# Altium project IMX93EVK-SOM.PrjPcb (part 6 of 6)
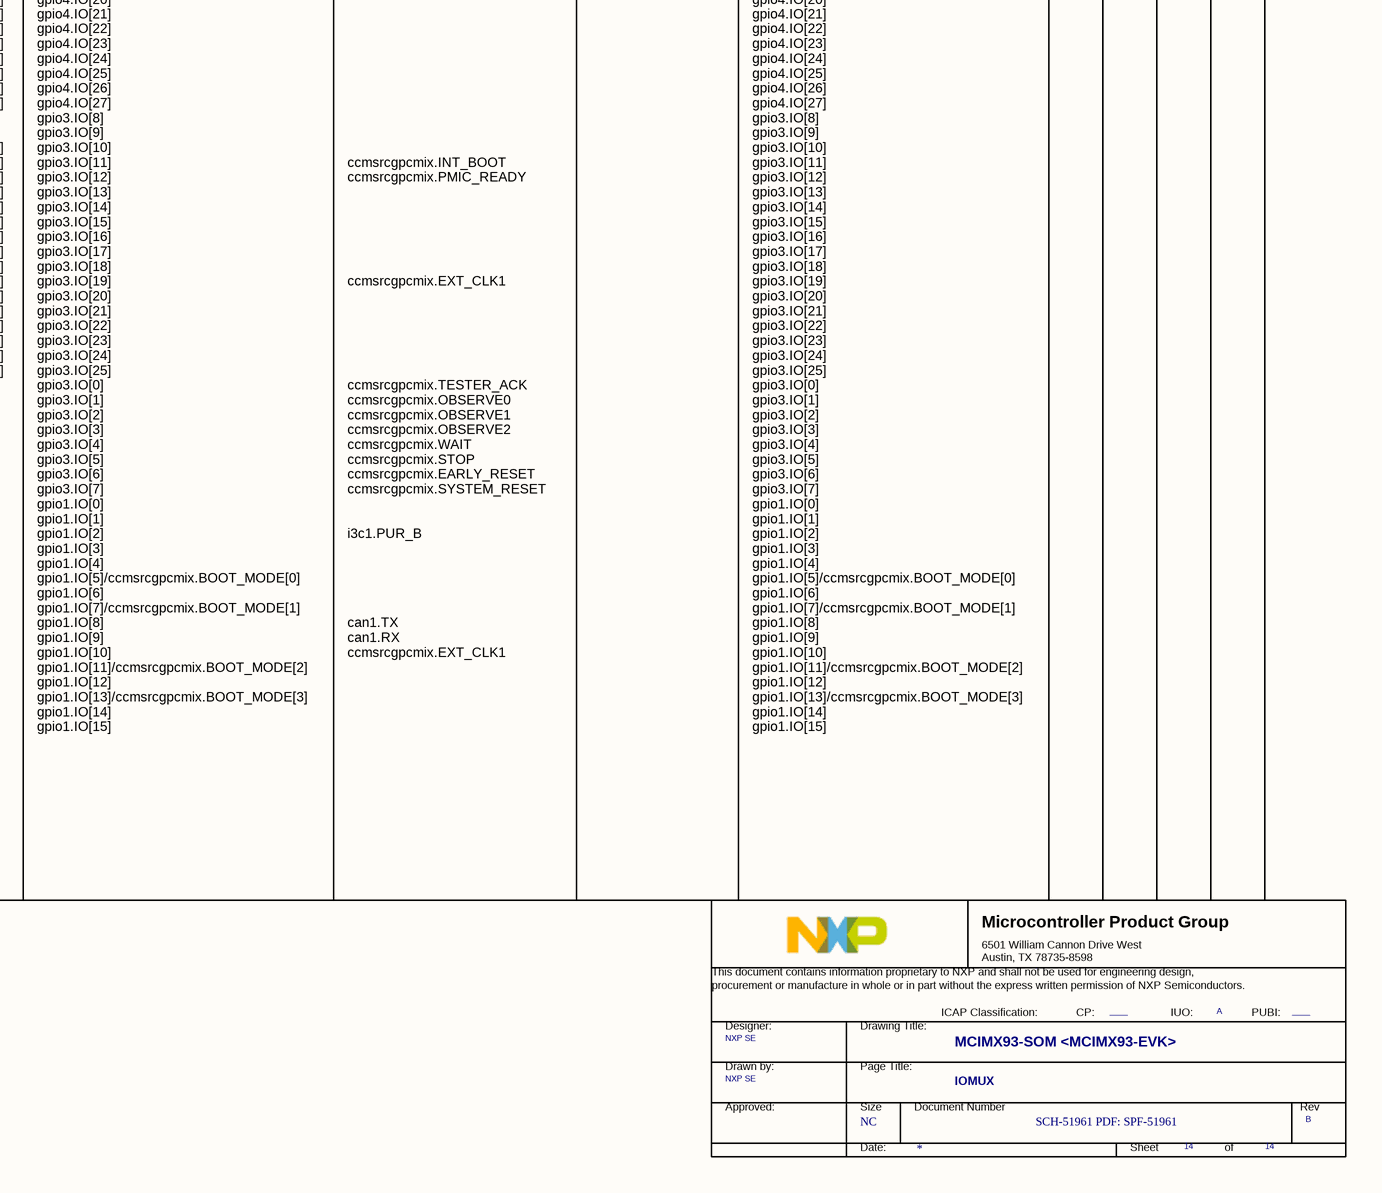
[diagram p34: X-14 IOMUX.SchDoc, bottom right]

## Nets that join several sheets
BB_VSYS_5V: C-11 SOM HDR (13 pins), C-12 PWR MEAS (9 pins)
GND: C-04 CPU PWR (95 pins), C-05 LPDDR4_x (84 pins), C-06 CPU IO_PHY (R302.1 R303.2 R305.2), C-07 CPU MISC (12 pins), C-08 eMMC (20 pins), C-09 BOOT_CFG (8 pins), C-10 PMIC (35 pins), C-11 SOM HDR (88 pins), C-12 PWR MEAS (75 pins)
LPD4/x_VDD1: C-05 LPDDR4_x (15 pins), C-12 PWR MEAS (R1006.1 R1014.2 TP947.1)
LPD4/x_VDD2: C-05 LPDDR4_x (34 pins), C-12 PWR MEAS (R1017.2 R1026.1 TP951.1)
LPD4/x_VDD2_1V1: C-04 CPU PWR (R109.2), C-05 LPDDR4_x (R203.1), C-10 PMIC (6 pins), C-12 PWR MEAS (8 pins)
LPD4/x_VDDQ: C-05 LPDDR4_x (30 pins), C-12 PWR MEAS (R923.1 R1007.2 TP949.1)
LPD4/x_VDDQ_0V6: C-04 CPU PWR (R110.2), C-05 LPDDR4_x (R206.1), C-10 PMIC (R702.2 R704.2 TP702.1), C-12 PWR MEAS (8 pins)
NVCC_1P8: C-04 CPU PWR (6 pins), C-12 PWR MEAS (R1004.2 R1029.1 TP943.1)
NVCC_3P3: C-04 CPU PWR (R107.1 R112.2 R113.2), C-12 PWR MEAS (R989.1 R1003.2 TP952.1)
NVCC_AON: C-04 CPU PWR (C119.1 R112.1 U101.L16), C-06 CPU IO_PHY (R306.1 R307.1 R308.1 R309.1), C-09 BOOT_CFG (5 pins), C-10 PMIC (R705.1), C-11 SOM HDR (C804.1 J803.90)
NVCC_BBSM_1P8: C-04 CPU PWR (C101.1 R101.2 U101.G12), C-12 PWR MEAS (R903.1 R918.1 R920.2 TP924.1)
NVCC_BBSM_1V8: C-04 CPU PWR (R101.1), C-07 CPU MISC (R401.1 R404.1 R405.1), C-10 PMIC (C727.1 R703.1 TP709.1 U701.3), C-11 SOM HDR (C809.1 J802.53), C-12 PWR MEAS (7 pins)
NVCC_GPIO: C-04 CPU PWR (C118.1 R113.1 U101.N15 U101.N16), C-11 SOM HDR (C806.1 J803.89)
NVCC_SD: C-04 CPU PWR (R108.2), C-10 PMIC (C731.1 TP713.1 U701.55), C-12 PWR MEAS (R929.1 R998.1 TP934.1)
NVCC_SD2: C-04 CPU PWR (C129.1 R108.1 U101.R16), C-06 CPU IO_PHY (R310.1 R311.1 R312.1), C-11 SOM HDR (C808.1 J803.55), C-12 PWR MEAS (R935.1 R998.2 TP935.1)
VDD2_DDR: C-04 CPU PWR (13 pins), C-12 PWR MEAS (R939.1 R944.2 R958.1 TP930.1)
VDD_1P8: C-10 PMIC (6 pins), C-12 PWR MEAS (R1041.1 R1044.1 TP959.1)
VDD_1V8: C-04 CPU PWR (L102.1 R106.2), C-05 LPDDR4_x (R202.1), C-08 eMMC (11 pins), C-10 PMIC (R712.1 R713.1 R727.2), C-11 SOM HDR (9 pins), C-12 PWR MEAS (9 pins)
VDD_3P3: C-10 PMIC (6 pins), C-12 PWR MEAS (R1040.1 R1042.1 TP957.1)
VDD_3V3: C-04 CPU PWR (R105.1 R107.2), C-08 eMMC (7 pins), C-09 BOOT_CFG (R605.1), C-10 PMIC (C724.2 R726.2 U701.22), C-11 SOM HDR (11 pins), C-12 PWR MEAS (9 pins)
VDD_ANA_0P8: C-04 CPU PWR (11 pins), C-12 PWR MEAS (R999.2 R1000.1 TP937.1)
VDD_ANA_0V8: C-04 CPU PWR (R103.1), C-10 PMIC (C730.1 TP712.1 U701.1), C-12 PWR MEAS (R997.1 R999.1 TP936.1)
VDD_ANA_1P8: C-04 CPU PWR (16 pins), C-12 PWR MEAS (R909.1 R1001.2 TP939.1)
VDD_ANA_1V8: C-04 CPU PWR (L102.2 R104.1 R111.2), C-12 PWR MEAS (R905.1 R1001.1 TP938.1)
VDD_SOC: C-04 CPU PWR (27 pins), C-10 PMIC (R711.2), C-12 PWR MEAS (R927.1 R932.2 R1020.1 TP927.1)
VDD_SOC_0V8: C-04 CPU PWR (R102.1), C-10 PMIC (6 pins), C-12 PWR MEAS (5 pins)
VDD_USB_3P3: C-04 CPU PWR (C155.1 R105.2 U101.G10), C-12 PWR MEAS (R996.1 R1002.2 TP941.1)
VDDQ_DDR: C-04 CPU PWR (9 pins), C-12 PWR MEAS (R943.1 R947.1 R974.2 TP933.1)
VLDO3_1V8: C-04 CPU PWR (R111.1), C-10 PMIC (C729.1 TP711.1 U701.54)
VSD2_3V3: C-11 SOM HDR (6 pins), C-12 PWR MEAS (R967.1 R1031.2 TP945.1)
VSD_3V3: C-10 PMIC (C725.1 U701.23), C-11 SOM HDR (R801.1), C-12 PWR MEAS (R957.1 R1031.1 TP944.1)
VSYS_5V: C-09 BOOT_CFG (TP607.1), C-10 PMIC (20 pins), C-11 SOM HDR (R802.1), C-12 PWR MEAS (R904.2 R916.1 R984.1 TP921.1)
ADC_IN0: C-07 CPU MISC (TP413.1 U101.B19), C-11 SOM HDR (J802.72)
ADC_IN1: C-07 CPU MISC (TP414.1 U101.A20), C-11 SOM HDR (J802.74)
ADC_IN2: C-07 CPU MISC (TP415.1 U101.B20), C-11 SOM HDR (J802.78)
ADC_IN3: C-07 CPU MISC (TP416.1 U101.B21), C-11 SOM HDR (J802.80)
CLKIN1: C-07 CPU MISC (R415.1 TP418.1 U101.B17), C-11 SOM HDR (J802.67)
CLKIN2: C-07 CPU MISC (R416.1 TP419.1 U101.A18), C-11 SOM HDR (J802.69)
CLKO01: C-07 CPU MISC (U101.AA2), C-11 SOM HDR (J801.79)
CLKO02: C-07 CPU MISC (U101.Y3), C-11 SOM HDR (J801.77)
CLKO03: C-07 CPU MISC (U101.U4), C-11 SOM HDR (J801.75)
CLKO04: C-07 CPU MISC (U101.V4), C-11 SOM HDR (J801.73)
CSI_CLK_N: C-06 CPU IO_PHY (U101.D10), C-11 SOM HDR (J802.47)
CSI_CLK_P: C-06 CPU IO_PHY (U101.E10), C-11 SOM HDR (J802.45)
CSI_D0_N: C-06 CPU IO_PHY (U101.A11), C-11 SOM HDR (J802.41)
CSI_D0_P: C-06 CPU IO_PHY (U101.B11), C-11 SOM HDR (J802.39)
CSI_D1_N: C-06 CPU IO_PHY (U101.A10), C-11 SOM HDR (J802.35)
CSI_D1_P: C-06 CPU IO_PHY (U101.B10), C-11 SOM HDR (J802.33)
DSI_CLK_N: C-06 CPU IO_PHY (U101.D6), C-11 SOM HDR (J802.3)
DSI_CLK_P: C-06 CPU IO_PHY (U101.E6), C-11 SOM HDR (J802.5)
DSI_D0_N: C-06 CPU IO_PHY (U101.A6), C-11 SOM HDR (J802.9)
DSI_D0_P: C-06 CPU IO_PHY (U101.B6), C-11 SOM HDR (J802.11)
DSI_D1_N: C-06 CPU IO_PHY (U101.A7), C-11 SOM HDR (J802.15)
DSI_D1_P: C-06 CPU IO_PHY (U101.B7), C-11 SOM HDR (J802.17)
DSI_D2_N: C-06 CPU IO_PHY (U101.A8), C-11 SOM HDR (J802.21)
DSI_D2_P: C-06 CPU IO_PHY (U101.B8), C-11 SOM HDR (J802.23)
DSI_D3_N: C-06 CPU IO_PHY (U101.A9), C-11 SOM HDR (J802.27)
DSI_D3_P: C-06 CPU IO_PHY (U101.B9), C-11 SOM HDR (J802.29)
ENET1_MDC: C-06 CPU IO_PHY (U101.AA11), C-11 SOM HDR (J801.37)
ENET1_MDIO: C-06 CPU IO_PHY (U101.AA10), C-11 SOM HDR (J801.39)
ENET1_RD0: C-06 CPU IO_PHY (U101.AA8), C-11 SOM HDR (J801.49)
ENET1_RD1: C-06 CPU IO_PHY (U101.Y9), C-11 SOM HDR (J801.47)
ENET1_RD2: C-06 CPU IO_PHY (U101.AA9), C-11 SOM HDR (J801.43)
ENET1_RD3: C-06 CPU IO_PHY (U101.Y10), C-11 SOM HDR (J801.41)
ENET1_RX_CTL: C-06 CPU IO_PHY (U101.Y8), C-11 SOM HDR (J801.51)
ENET1_RXC: C-06 CPU IO_PHY (U101.AA7), C-11 SOM HDR (J801.53)
ENET1_TD0: C-06 CPU IO_PHY (U101.W11), C-11 SOM HDR (J801.44)
ENET1_TD1: C-06 CPU IO_PHY (U101.T12), C-11 SOM HDR (J801.42)
ENET1_TD2: C-06 CPU IO_PHY (U101.U12), C-11 SOM HDR (J801.40)
ENET1_TD3: C-06 CPU IO_PHY (U101.V12), C-11 SOM HDR (J801.38)
ENET1_TX_CTL: C-06 CPU IO_PHY (U101.V10), C-11 SOM HDR (J801.48)
ENET1_TXC: C-06 CPU IO_PHY (U101.U10), C-11 SOM HDR (J801.50)
ENET2_MDC: C-06 CPU IO_PHY (U101.Y7), C-11 SOM HDR (J801.54)
ENET2_MDIO: C-06 CPU IO_PHY (U101.AA6), C-11 SOM HDR (J801.56)
ENET2_RD0: C-06 CPU IO_PHY (U101.AA4), C-11 SOM HDR (J801.63)
ENET2_RD1: C-06 CPU IO_PHY (U101.Y5), C-11 SOM HDR (J801.61)
ENET2_RD2: C-06 CPU IO_PHY (U101.AA5), C-11 SOM HDR (J801.59)
ENET2_RD3: C-06 CPU IO_PHY (U101.Y6), C-11 SOM HDR (J801.57)
ENET2_RX_CTL: C-06 CPU IO_PHY (U101.Y4), C-11 SOM HDR (J801.67)
ENET2_RXC: C-06 CPU IO_PHY (U101.AA3), C-11 SOM HDR (J801.69)
ENET2_TD0: C-06 CPU IO_PHY (U101.T8), C-11 SOM HDR (J801.66)
ENET2_TD1: C-06 CPU IO_PHY (U101.U8), C-11 SOM HDR (J801.64)
ENET2_TD2: C-06 CPU IO_PHY (U101.V8), C-11 SOM HDR (J801.60)
ENET2_TD3: C-06 CPU IO_PHY (U101.T10), C-11 SOM HDR (J801.58)
ENET2_TX_CTL: C-06 CPU IO_PHY (U101.V6), C-11 SOM HDR (J801.68)
ENET2_TXC: C-06 CPU IO_PHY (U101.U6), C-11 SOM HDR (J801.70)
GPIO_IO00: C-06 CPU IO_PHY (U101.J21), C-11 SOM HDR (J803.22)
GPIO_IO01: C-06 CPU IO_PHY (U101.J20), C-11 SOM HDR (J803.24)
GPIO_IO02: C-06 CPU IO_PHY (U101.K20), C-11 SOM HDR (J803.28)
GPIO_IO03: C-06 CPU IO_PHY (U101.K21), C-11 SOM HDR (J803.26)
GPIO_IO04: C-06 CPU IO_PHY (U101.L17), C-11 SOM HDR (J803.23)
GPIO_IO05: C-06 CPU IO_PHY (U101.L18), C-11 SOM HDR (J803.21)
GPIO_IO06: C-06 CPU IO_PHY (U101.L20), C-11 SOM HDR (J803.27)
GPIO_IO07: C-06 CPU IO_PHY (U101.L21), C-11 SOM HDR (J803.25)
GPIO_IO08: C-06 CPU IO_PHY (U101.M20), C-11 SOM HDR (J803.33)
GPIO_IO09: C-06 CPU IO_PHY (U101.M21), C-11 SOM HDR (J803.31)
GPIO_IO10: C-06 CPU IO_PHY (U101.N17), C-11 SOM HDR (J803.34)
GPIO_IO11: C-06 CPU IO_PHY (U101.N18), C-11 SOM HDR (J803.32)
GPIO_IO12: C-06 CPU IO_PHY (U101.N20), C-11 SOM HDR (J803.37)
GPIO_IO13: C-06 CPU IO_PHY (U101.N21), C-11 SOM HDR (J803.35)
GPIO_IO14: C-06 CPU IO_PHY (U101.P20), C-11 SOM HDR (J803.42)
GPIO_IO15: C-06 CPU IO_PHY (U101.P21), C-11 SOM HDR (J803.41)
GPIO_IO16: C-06 CPU IO_PHY (U101.R21), C-11 SOM HDR (J803.43)
GPIO_IO17: C-06 CPU IO_PHY (U101.R20), C-11 SOM HDR (J803.44)
GPIO_IO18: C-06 CPU IO_PHY (U101.R18), C-11 SOM HDR (J803.36)
GPIO_IO19: C-06 CPU IO_PHY (U101.R17), C-11 SOM HDR (J803.38)
GPIO_IO20: C-06 CPU IO_PHY (U101.T20), C-11 SOM HDR (J803.48)
GPIO_IO21: C-06 CPU IO_PHY (U101.T21), C-11 SOM HDR (J803.46)
GPIO_IO22: C-06 CPU IO_PHY (U101.U18), C-11 SOM HDR (J803.45)
GPIO_IO23: C-06 CPU IO_PHY (U101.U20), C-11 SOM HDR (J803.52)
GPIO_IO24: C-06 CPU IO_PHY (U101.U21), C-11 SOM HDR (J803.47)
GPIO_IO25: C-06 CPU IO_PHY (U101.V21), C-11 SOM HDR (J803.51)
GPIO_IO26: C-06 CPU IO_PHY (U101.V20), C-11 SOM HDR (J803.53)
GPIO_IO27: C-06 CPU IO_PHY (U101.W21), C-11 SOM HDR (J803.54)
GPIO_IO28: C-06 CPU IO_PHY (U101.W20), C-11 SOM HDR (J803.56)
GPIO_IO29: C-06 CPU IO_PHY (U101.Y21), C-11 SOM HDR (J803.58)
I2C1_SCL: C-06 CPU IO_PHY (R307.2 U101.C20), C-10 PMIC (R717.1), C-11 SOM HDR (J803.4)
I2C1_SDA: C-06 CPU IO_PHY (R306.2 U101.C21), C-10 PMIC (R719.1), C-11 SOM HDR (J803.2)
I2C2_SCL: C-06 CPU IO_PHY (R309.2 U101.D20), C-10 PMIC (R714.1), C-11 SOM HDR (J803.8)
I2C2_SDA: C-06 CPU IO_PHY (R308.2 U101.D21), C-10 PMIC (R715.1), C-11 SOM HDR (J803.6)
JTAG_TCK: C-07 CPU MISC (R403.1 TP404.1 U101.Y1), C-11 SOM HDR (J801.76)
JTAG_TDI: C-07 CPU MISC (TP402.1 U101.W1), C-11 SOM HDR (J801.80)
JTAG_TDO: C-07 CPU MISC (TP405.1 U101.Y2), C-11 SOM HDR (J801.74)
JTAG_TMS: C-07 CPU MISC (TP403.1 U101.W2), C-11 SOM HDR (J801.78)
LVDS_CLK_N: C-06 CPU IO_PHY (U101.A3), C-11 SOM HDR (J802.18)
LVDS_CLK_P: C-06 CPU IO_PHY (U101.B3), C-11 SOM HDR (J802.16)
LVDS_TX0_N: C-06 CPU IO_PHY (U101.A5), C-11 SOM HDR (J802.30)
LVDS_TX0_P: C-06 CPU IO_PHY (U101.B5), C-11 SOM HDR (J802.28)
LVDS_TX1_N: C-06 CPU IO_PHY (U101.A4), C-11 SOM HDR (J802.24)
LVDS_TX1_P: C-06 CPU IO_PHY (U101.B4), C-11 SOM HDR (J802.22)
LVDS_TX2_N: C-06 CPU IO_PHY (U101.A2), C-11 SOM HDR (J802.12)
LVDS_TX2_P: C-06 CPU IO_PHY (U101.B2), C-11 SOM HDR (J802.10)
LVDS_TX3_N: C-06 CPU IO_PHY (U101.B1), C-11 SOM HDR (J802.6)
LVDS_TX3_P: C-06 CPU IO_PHY (U101.C1), C-11 SOM HDR (J802.4)
ONOFF: C-07 CPU MISC (R405.2 TP401.1 U101.A19), C-11 SOM HDR (J802.75)
PDM_CLK: C-06 CPU IO_PHY (U101.G17), C-11 SOM HDR (J803.11)
PDM_DATA0: C-06 CPU IO_PHY (U101.J17), C-11 SOM HDR (J803.13)
PDM_DATA1: C-06 CPU IO_PHY (U101.G18), C-11 SOM HDR (J803.15)
PMIC_32K_OUT: C-07 CPU MISC (R411.1), C-10 PMIC (U701.7), C-11 SOM HDR (J801.34)
PMIC_nINT: C-10 PMIC (U701.13), C-11 SOM HDR (J801.32)
PMIC_ON_REQ: C-07 CPU MISC (R401.2 R418.1 TP407.1 U101.A17), C-10 PMIC (R707.1), C-11 SOM HDR (J802.63)
PMIC_SCLH: C-10 PMIC (R724.1), C-11 SOM HDR (J801.31)
PMIC_SCLL: C-10 PMIC (R712.2 U701.27), C-11 SOM HDR (J801.27)
PMIC_SDAH: C-10 PMIC (R725.1), C-11 SOM HDR (J801.33)
PMIC_SDAL: C-10 PMIC (R713.2 U701.26), C-11 SOM HDR (J801.29)
PMIC_STBY_REQ: C-07 CPU MISC (R417.1 TP409.1 U101.B18), C-10 PMIC (R708.1), C-11 SOM HDR (J802.73)
POR_B: C-07 CPU MISC (R406.1), C-10 PMIC (U701.9), C-11 SOM HDR (J802.57), C-12 PWR MEAS (Q901.2 R971.2)
SAI1_RXD0: C-06 CPU IO_PHY (U101.H20), C-11 SOM HDR (J803.18)
SAI1_TXC: C-06 CPU IO_PHY (U101.G20), C-11 SOM HDR (J803.14)
SAI1_TXD0: C-06 CPU IO_PHY (U101.H21), C-09 BOOT_CFG (R604.2 R612.1 TP604.1), C-11 SOM HDR (J803.16)
SAI1_TXFS: C-06 CPU IO_PHY (U101.G21), C-09 BOOT_CFG (R603.2 R611.1 TP603.1), C-11 SOM HDR (J803.12)
SD1_CLK: C-06 CPU IO_PHY (U101.Y11), C-08 eMMC (TP503.1 U501.M6)
SD1_CMD: C-06 CPU IO_PHY (U101.AA12), C-08 eMMC (R502.2 TP502.1 U501.M5)
SD1_DATA0: C-06 CPU IO_PHY (U101.AA14), C-08 eMMC (R501.2 TP501.1 U501.A3)
SD1_DATA1: C-06 CPU IO_PHY (U101.AA15), C-08 eMMC (U501.A4)
SD1_DATA2: C-06 CPU IO_PHY (U101.AA16), C-08 eMMC (U501.A5)
SD1_DATA3: C-06 CPU IO_PHY (U101.AA13), C-08 eMMC (U501.B2)
SD1_DATA4: C-06 CPU IO_PHY (U101.Y13), C-08 eMMC (U501.B3)
SD1_DATA5: C-06 CPU IO_PHY (U101.Y14), C-08 eMMC (U501.B4)
SD1_DATA6: C-06 CPU IO_PHY (U101.Y15), C-08 eMMC (U501.B5)
SD1_DATA7: C-06 CPU IO_PHY (U101.Y16), C-08 eMMC (U501.B6)
SD1_STROBE: C-06 CPU IO_PHY (U101.Y12), C-08 eMMC (TP505.1 U501.H5)
SD2_CLK: C-06 CPU IO_PHY (U101.AA19), C-11 SOM HDR (J803.65)
SD2_CMD: C-06 CPU IO_PHY (R311.2 U101.Y19), C-11 SOM HDR (J803.63)
SD2_DATA0: C-06 CPU IO_PHY (R310.2 U101.Y18), C-11 SOM HDR (J803.69)
SD2_DATA1: C-06 CPU IO_PHY (U101.AA18), C-11 SOM HDR (J803.71)
SD2_DATA2: C-06 CPU IO_PHY (U101.Y20), C-11 SOM HDR (J803.59)
SD2_DATA3: C-06 CPU IO_PHY (U101.AA20), C-11 SOM HDR (J803.61)
SD2_nCD: C-06 CPU IO_PHY (U101.Y17), C-11 SOM HDR (J803.73)
SD2_RESET_B: C-06 CPU IO_PHY (R312.2 U101.AA17), C-10 PMIC (R723.2)
SD2_VSEL: C-06 CPU IO_PHY (U101.V18), C-10 PMIC (U701.29)
SD3_CLK: C-06 CPU IO_PHY (U101.V16), C-11 SOM HDR (J803.62)
SD3_CMD: C-06 CPU IO_PHY (U101.U16), C-11 SOM HDR (J803.64)
SD3_DATA0: C-06 CPU IO_PHY (U101.T16), C-11 SOM HDR (J803.66)
SD3_DATA1: C-06 CPU IO_PHY (U101.V14), C-11 SOM HDR (J803.70)
SD3_DATA2: C-06 CPU IO_PHY (U101.U14), C-11 SOM HDR (J803.72)
SD3_DATA3: C-06 CPU IO_PHY (U101.T14), C-11 SOM HDR (J803.74)
SYS_nRST: C-10 PMIC (R706.1 TP915.1), C-11 SOM HDR (J802.77)
TAMPER0: C-07 CPU MISC (TP410.1 U101.B16), C-11 SOM HDR (J802.61)
TAMPER1: C-07 CPU MISC (TP411.1 U101.F14), C-11 SOM HDR (J802.59)
UART1_RXD: C-06 CPU IO_PHY (U101.E20), C-09 BOOT_CFG (TP612.1), C-11 SOM HDR (J803.3)
UART1_TXD: C-06 CPU IO_PHY (U101.E21), C-09 BOOT_CFG (R601.2 R609.1 TP610.1), C-11 SOM HDR (J803.1)
UART2_RXD: C-06 CPU IO_PHY (U101.F20), C-09 BOOT_CFG (TP616.1), C-11 SOM HDR (J803.7)
UART2_TXD: C-06 CPU IO_PHY (U101.F21), C-09 BOOT_CFG (R602.2 R610.1 TP614.1), C-11 SOM HDR (J803.5)
USB1_DN: C-06 CPU IO_PHY (U101.A14), C-09 BOOT_CFG (TP611.1), C-11 SOM HDR (J802.50)
USB1_DP: C-06 CPU IO_PHY (U101.B14), C-09 BOOT_CFG (TP613.1), C-11 SOM HDR (J802.52)
USB1_ID: C-06 CPU IO_PHY (U101.C11), C-11 SOM HDR (J802.56)
USB1_RXN: C-06 CPU IO_PHY (U101.A12), C-11 SOM HDR (J802.34)
USB1_RXP: C-06 CPU IO_PHY (U101.B12), C-11 SOM HDR (J802.36)
USB1_TXN: C-06 CPU IO_PHY (U101.A13), C-11 SOM HDR (J802.40)
USB1_TXP: C-06 CPU IO_PHY (U101.B13), C-11 SOM HDR (J802.42)
USB1_VBUS_3V3: C-06 CPU IO_PHY (R301.2), C-09 BOOT_CFG (R613.2 R614.1), C-11 SOM HDR (J802.46)
USB2_DN: C-06 CPU IO_PHY (U101.A15), C-11 SOM HDR (J802.62)
USB2_DP: C-06 CPU IO_PHY (U101.B15), C-11 SOM HDR (J802.64)
USB2_ID: C-06 CPU IO_PHY (U101.E12), C-11 SOM HDR (J802.68)
USB2_VBUS_3V3: C-06 CPU IO_PHY (R304.2), C-11 SOM HDR (J802.58)
WDOG_B: C-06 CPU IO_PHY (U101.J18), C-10 PMIC (R710.1 TP916.1), C-11 SOM HDR (J803.17)

## Assembly variants
NXP Production: not fitted C405 C705 C708 C711 C720 C723 C902 C905 C907 C908 C910 C917 C920 C924 C927 C932 C933 C936 C939 C940 C941 C945 C948 C949 C950 C951 C952 C953 C954 R101 R102 R103 R104 R105 R106 R107 R108 R109 R110 R111 R202 R203 R205 R206 R207 R208 R310 R311 R401 R411 R413 R414 R501 R502 R601 R603 R604 R609 R610 R611 R612 R702 R703 R711 R716 R720 R726 R727 R801 R802 R902 R903 R911 R914 R916 R934 R956 R971 R994 R1025
No_Power_Monitoring: not fitted BH801 BH802 BH803 BH804 C405 C705 C708 C711 C720 C723 C901 C902 C903 C904 C905 C906 C907 C908 C909 C910 C911 C912 C913 C917 C920 C921 C922 C923 C924 C925 C926 C927 C930 C931 C932 C933 C934 C935 C936 C937 C938 C939 C940 C941 C945 C946 C947 C948 C949 C950 C951 C952 C953 C954 R111 R205 R207 R208 R310 R311 R401 R403 R411 R413 R414 R501 R502 R601 R603 R604 R609 R610 R611 R612 R614 R702 R703 R711 R716 R720 R901 R902 R903 R904 R905 R906 R907 R908 R909 R910 R911 R912 R913 R914 R915 R916 R917 R918 R919 R920 R921 R922 R923 R924 R926 R927 R928 R929 R930 R931 R932 R933 R934 R935 R936 R937 R938 R939 R941 R942 R943 R944 R945 R946 R947 R948 R949 R950 R951 R955 R956 R957 R958 R959 R967 R971 R973 R974 R983 R984 R985 R987 R988 R989 R990 R991 R992 R993 R994 R995 R996 R997 R998 R999 R1000 R1001 R1002 R1003 R1004 R1005 R1006 R1007 R1008 R1014 R1017 R1019 R1020 R1021 R1022 R1023 R1024 R1025 R1026 R1027 R1028 R1029 R1031 R1040 R1041 R1042 R1043 R1044 R1045 U901 U902 U903 U904 U906 U907 U908 U910 U911 U912